# Altium schematic sheet SIM CARD .SchDoc: SIM868 Development Board
size 199 x 149 mm; SheetNumber: 11; SheetTotal: 14
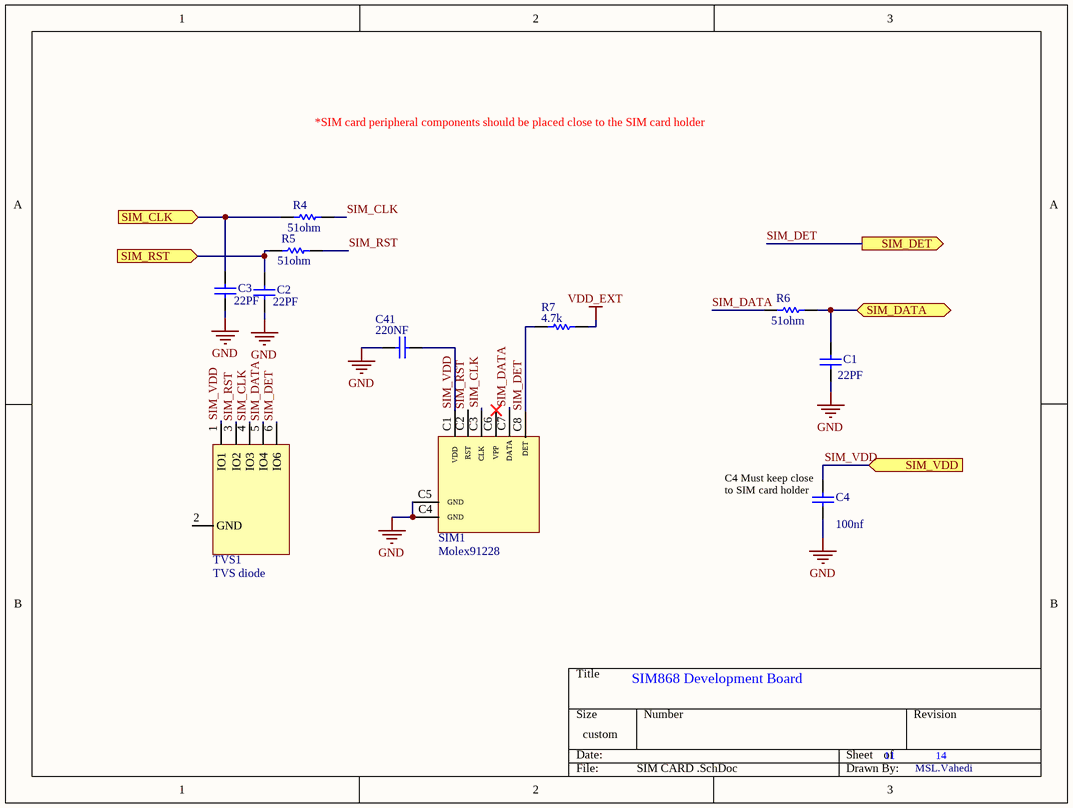
[diagram p0: SIM CARD .SchDoc]

## Parts
C1  value 22PF  [CAP0805]
C2  value 22PF  [CAP0805]
C3  value 22PF  [CAP0805]
C4  value 100nf  [CAP0805]
C41  value 220NF  [RES0805]
R4  value 51ohm  [RES0805]
R5  value 51ohm  [RES0805]
R6  value 51ohm  [RES0805]
R7  value 4.7k  [RES0805]
SIM1  Molex91228  [molex 91228]
TVS1  TVS diode  [*DIO_ESDA6V1-5W6]

## Ports
SIM_CLK (in), SIM_DATA (bidir), SIM_DET (out), SIM_RST (in), SIM_VDD (in)

## Nets
GND: C1.1 C2.1 C3.1 C4.2 C41.2 SIM1.C4(GND) SIM1.C5(GND)
VDD_EXT: R7.2
SIM_CLK: C3.2 R4.2 ; port SIM_CLK
SIM_CLK: R4.1 SIM1.C3(CLK) TVS1.4(IO3)  [a separate net that carries the same name]
SIM_DATA: R6.2 SIM1.C7(DATA) TVS1.5(IO4)
SIM_DATA: C1.2 R6.1 ; port SIM_DATA  [a separate net that carries the same name]
SIM_DET: R7.1 SIM1.C8(DET) TVS1.6(IO6) ; port SIM_DET
SIM_RST: C2.2 R5.2 ; port SIM_RST
SIM_RST: R5.1 SIM1.C2(RST) TVS1.3(IO2)  [a separate net that carries the same name]
SIM_VDD: C4.1 C41.1 SIM1.C1(VDD) TVS1.1(IO1) ; port SIM_VDD

Not connected (* = marked no-connect by the designer): SIM1 C6(VPP)*; TVS1 2(GND_)

## Notes on the sheet
- *SIM card peripheral components should be placed close to the SIM card holder
- (near C4) C4 Must keep close to SIM card holder
- MSL.Vahedi

## Library data of the parts
C1-C4 C41 = Cap: Capacitor; Published: 8-Jun-2000; LatestRevisionDate: 17-Jul-2002; LatestRevisionNote: Re-released for DXP Platform.; PackageReference: RAD-0.3; Publisher: Altium Limited; PackageDescription: Radial Cap, Thru-Hole; 2 Leads; 0.3 in Pin Spacing
R4-R7 = Res1: Resistor; Published: 8-Jun-2000; LatestRevisionDate: 17-Jul-2002; LatestRevisionNote: Re-released for DXP Platform.; PackageReference: AXIAL-0.3; Publisher: Altium Limited; PackageDescription: Axial Device, Thru-Hole; 2 Leads; 0.3 in Pin Spacing
TVS1 = ESDA6V1